# EAGLE design MO_v1 (EAGLE 7.1.0)
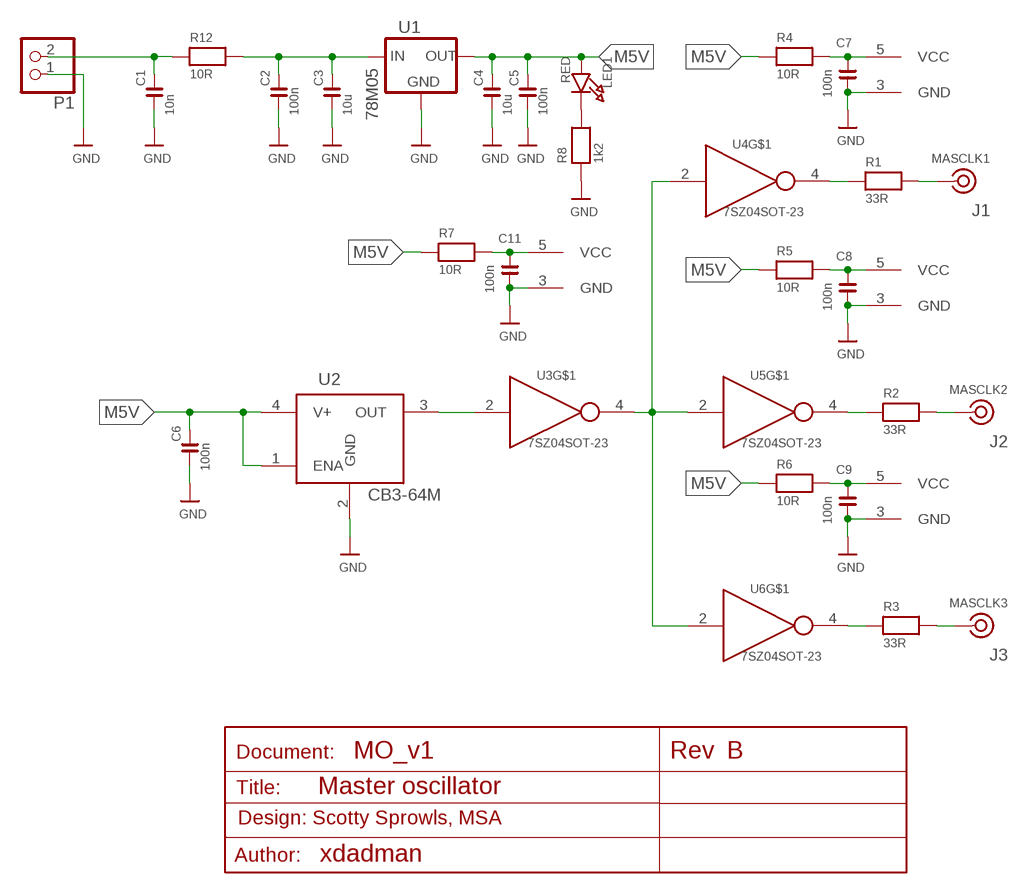
[diagram p0: schematic, sheet 1]

## Parts
C1  10n  C080510N  [C0805]
C2  100n  C0805100N  [C0805]
C3  10u  CC120610U  [C1206]
C4  10u  CC120610U  [C1206]
C5  100n  C0805100N  [C0805]
C6  100n  C0805100N  [C0805]
C7  100n  C0805100N  [C0805]
C8  100n  C0805100N  [C0805]
C9  100n  C0805100N  [C0805]
C11  100n  C0805100N  [C0805]
J1  MASCLK1  COAX  [SLIM_COAX_PAD]
J2  MASCLK2  COAX  [SLIM_COAX_PAD]
J3  MASCLK3  COAX  [SLIM_COAX_PAD]
LED1  RED  LED_0603_RED0603  [CHIPLED_0603]
P1  PINHD-1X2  [1X02]
R1  33R  R0805R33  [R0805]
R2  33R  R0805R33  [R0805]
R3  33R  R0805R33  [R0805]
R4  10R  R080510R  [R0805]
R5  10R  R080510R  [R0805]
R6  10R  R080510R  [R0805]
R7  10R  R080510R  [R0805]
R8  1k2  R08051K2  [R0805]
R12  10R  R080510R  [R0805]
U1  78M05  78MXXLDPAK  [TO252]
U2  CB3-64M  [CB3-64M]
U3  7SZ04SOT-23  [SOT23-5L]
U4  7SZ04SOT-23  [SOT23-5L]
U5  7SZ04SOT-23  [SOT23-5L]
U6  7SZ04SOT-23  [SOT23-5L]

## Nets
+10V: C1.2 P1.2 R12.1
GND: C1.1 C2.1 C3.1 C4.1 C5.1 C6.1 C7.1 C8.1 C9.1 C11.1 P1.1 R8.1 U1.3(GND) U2.2(GND) U3.3(GND) U4.3(GND) U5.3(GND) U6.3(GND)
M5V: C4.2 C5.2 C6.2 LED1.A R4.1 R5.1 R6.1 R7.1 U1.2(OUT) U2.1(ENA) U2.4(V+)
N$1: C2.2 C3.2 R12.2 U1.1(IN)
N$2: U2.3(OUT) U3.2(IN)
N$3: C7.2 R4.2 U4.5(VCC)
N$4: C11.2 R7.2 U3.5(VCC)
N$5: C8.2 R5.2 U5.5(VCC)
N$6: U3.4(OUT) U4.2(IN) U5.2(IN) U6.2(IN)
N$7: C9.2 R6.2 U6.5(VCC)
N$8: R1.1 U4.4(OUT)
N$9: R2.1 U5.4(OUT)
N$10: R3.1 U6.4(OUT)
N$11: J3.SIG R3.2
N$12: J2.SIG R2.2
N$13: J1.SIG R1.2
N$14: LED1.C R8.2

## Notes on the sheet
- B
- Master oscillator
- Design: Scotty Sprowls, MSA
- xdadman

## Power pins joined to a net without a drawn wire
GND: J1.GND J2.GND J3.GND

## Library data of the parts
C1 = MSA_lib:C0805: Ceramic capacitor; OC_FARNELL: 1414662
C2 C5-C9 C11 = MSA_lib:C0805: Ceramic capacitor; OC_FARNELL: 1759166
C3 C4 = MSA_lib:CC1206: Capacitor ceramic 1206; OC_FARNELL: 1611967
J1-J3 = MSA_lib:COAX
LED1 = MSA_lib:LED_0603_RED: Chip LED 0603 RED 2ma; OC_FARNELL: 1685068
P1 = MSA_lib:PINHD-1X2: PIN HEADER
R1-R3 = MSA_lib:R0805: Resistors; OC_FARNELL: 8867542
R4-R7 R12 = MSA_lib:R0805: Resistors; OC_FARNELL: 2332043
R8 = MSA_lib:R0805: Resistors; OC_FARNELL: 9333827
U1 = MSA_lib:78MXXL: VOLTAGE REGULATOR; OC_FARNELL: 2382524
U2 = MSA_lib:CB3-64M: Crystal oscilator; OC_DIGIKEY: CTX286CT-ND
U3-U6 = MSA_lib:7SZ04; OC_FARNELL: 1417667

## Board

Size 32 x 32 mm. Coordinates in mm from the lower left corner, seen from the top.
Outline: 0,0 32,0 32,32 0,32 0,0
Copper layers (1*16): Top 0.035mm / dielectric 1.5mm / Bottom 0.035mm
Design rules "kuba_no_CLR": minimum track width 8mil, minimum drill 15mil, track to track 8mil, track to pad 8mil, pad to pad 8mil, via to via 8mil, smd to smd 8mil, copper to edge 0mil, drill to drill 8mil, minimum pad ring 12mil, minimum via ring 10mil, stop-mask expansion 4mil, vias tented up to drill 0mil, thermal gap 10mil

### Footprints (pad centres in the part's own frame; a part is rotated, then mirrored left to right if it is on the bottom)
C0805 = smd 1.2 x 1.5: 1 -0.953,0; 2 0.953,0
C1206 = smd 1.6 x 1.8: 1 -1.4,0; 2 1.4,0
SLIM_COAX_PAD = smd 1.27 x 0.635 bottom: GND 0,-2.667 | drill 1.1: SIG 0,0
CHIPLED_0603 = smd 0.8 x 0.8: A 0,-0.75; C 0,0.75
1X02 = drill 1.016: 1 -1.27,0; 2 1.27,0
R0805 = smd 1.3 x 1.5: 1 -0.95,0; 2 0.95,0
TO252 = smd 1 x 1.6: 1 -2.28,-4.8; 2 2.28,-4.8 | smd 5.4 x 6.2: 3 0,2.5
CB3-64M = smd 1.8 x 2.1: 1 -2.5,-2.1; 2 2.5,-2.1; 3 2.5,2.1; 4 -2.5,2.1
SOT23-5L = smd 0.55 x 1.2: 1 -0.95,-1.3; 2 0,-1.3; 3 0.95,-1.3; 4 0.95,1.3; 5 -0.95,1.3

### Placement (x,y rotation side)
C1  21.08,5.33 180 top
C2  23.88,4.32 270 top
C3  26.42,4.83 270 top
C4  26.42,8.64 180 top
C5  22.86,8.13 90 top
C6  27.69,14.99 270 top
C7  12.7,22.1 180 top
C8  18.29,23.11 90 top
C9  9.91,17.78 270 top
C11  17.27,14.73 180 top
J1  6.1,25.65 180 top
J2  25.91,25.65 180 top
J3  6.1,11.43 270 top
LED1  20.57,10.16 90 top
P1  14.48,5.33 0 top
R1  8.64,25.65 180 top
R2  23.37,25.65 0 top
R3  6.1,13.72 270 top
R4  8.89,22.1 0 top
R5  20.07,27.18 270 top
R6  9.91,13.97 90 top
R7  16.51,8.64 90 top
R8  18.29,11.18 270 top
R12  18.29,4.32 270 top
U1  8.38,5.08 90 top
U2  22.86,14.99 90 top
U3  17.27,17.53 90 top
U4  12.45,24.64 90 top
U5  21.08,23.11 0 top
U6  7.11,17.53 180 top

### Tracks (layer width: path | path; a pad name or v marks a point on that pad's centre or on a via)
+10V
  Top 0.813: P1.2 18.35,5.33 | C1.2 18.35,5.33 | 18.35,5.33 R12.1
GND  (via drill 0.5)  (1 unrouted)
  Top 0.406: R8.1 v18.29,12.95
  Top 0.61: U2.2 26.12,17.49 v26.16,17.53 | U5.3 22.03,21.4 v22.35,21.08 | U3.3 18.73,18.48 v19.05,18.8 | C11.1 v19.05,14.73 | C7.1 13.65,21.91 v14.22,21.34 | C9.1 10.6,18.73 v10.67,18.8 | U6.3 6.16,18.98 v5.84,19.3 | U4.3 14.41,25.59 v14.48,25.65 | 29.97,8.51 29.97,5.33 | C8.1 v18.29,21.34 | v29.72,6.35 29.72,5.59 29.97,5.33 | 30.23,5.08 29.97,5.33
  Top 0.813: U2.2 25.44,17.49 26.92,16 27.62,16 C6.1 | C4.1 29.84,8.64 29.97,8.51 | C5.1 22.04,6.35 C1.1 23.81,5.33 C2.1 24.83,5.27 25.65,6.1 26.29,6.1 C3.1
  Top 1.016: 1.78,1.52 4.57,1.52 | 1.78,0.51 4.57,0.51
  Bottom 0.406: v18.29,12.95 18.29,12.7
  Bottom 0.61: v26.16,17.53 25.91,17.53 | v22.35,21.08 22.35,20.57 | v19.05,18.8 19.3,18.8 | v19.05,14.73 18.8,14.73 | v14.22,21.34 14.22,21.08 | v10.67,18.8 10.92,18.8 | v5.84,19.3 5.59,19.3 5.33,19.05 | v14.48,25.65 14.48,25.91 14.73,26.16 | v29.72,6.35 29.72,4.06 | v18.29,21.34 17.78,21.34
  other vias: 2.03,1.78 11.18,1.52 6.86,3.3 6.6,7.37 3.81,7.37 3.81,3.3 2.03,5.84 2.03,10.16 2.03,13.97 2.03,18.29 15.75,1.52 21.34,1.52 29.72,1.52 25.65,1.52 2.03,22.1 2.03,26.42 2.03,29.97 6.35,29.97 10.41,29.97 14.22,29.97 18.03,29.97 22.1,29.97 25.65,29.97 29.46,29.97 29.97,25.4 29.97,20.32 29.97,16.26 29.97,10.92 26.42,6.35
  pour Top (no thermals): 3.3,0 32,0 32,32 0,32 0,0 3.05,0 3.05,28.96 28.96,28.96 28.96,2.03 3.3,2.03
  pour Bottom: 0,0 32,0 32,32 0,32
M5V
  Top 0.406: LED1.A 21.32,9.16 21.34,9.14
  Top 0.61: 3.81,22.1 3.81,26.67 5.08,27.94 19.88,27.94 R5.1 | R6.1 9.91,9.65 | R4.1 3.81,22.1 | 3.81,22.1 3.81,10.67 5.08,9.4 9.91,9.4 10.03,9.53
  Top 0.813: 9.91,9.65 10.03,9.53 12.19,7.37 U1.2 16.18,7.36 R7.1 18.86,7.69 20.32,9.14 21.34,9.14 22.8,9.14 C5.2 | C6.2 27.5,14.22 27.18,14.22 25.44,12.49 U2.1 24.96,9.14 | 24.96,9.14 24.96,8.69 C4.2 | C5.2 24.9,9.08 24.96,9.14 | U2.4 20.79,12.49 22.86,10.41 C5.2
N$1
  Top 0.813: U1.1 13.44,3.05 17.97,3.05 R12.2 C2.2 26.36,3.37 C3.2
N$2
  Top 0.61: U3.2 20.72,17.53 U2.3
N$3
  Top 0.61: R4.2 11.18,22.1 | 11.18,22.1 C7.2 | U4.5 11.15,22.13 11.18,22.1
N$4
  Top 0.61: U3.5 15.97,15.08 C11.2 16.51,14.54 R7.2
N$5
  Top 0.61: R5.2 20.13,26.16 U5.5 18.64,24.41 C8.2
N$6
  Top 0.61: U4.2 14.99,24.64 15.75,23.88 15.75,20.07 | 15.75,20.07 20.83,20.07 21.08,20.32 U5.2 | U6.2 7.11,19.56 7.62,20.07 15.75,20.07 | U3.4 15.75,18.7 15.75,20.07
N$7
  Top 0.61: U6.5 9.88,16.23 9.91,16.26 C9.2 R6.2
N$8
  Top 0.61: R1.1 11.08,25.65 U4.4
N$9
  Top 0.61: U5.4 22.03,25.27 R2.1
N$10
  Top 0.61: U6.4 6.16,14.73 R3.1
N$11
  Top 1.016: R3.2 J3.SIG
N$12
  Top 1.27: J2.SIG R2.2
N$13
  Top 1.27: J1.SIG R1.2
N$14
  Top 0.406: LED1.C 18.35,10.16 R8.2

### Text on the board
tPlace: J1-CLK1 | R2 | U4 | R5 | R1 | J2-CLK2 | U5 | R4 | C8 | C9 | C7 | U2 | U6 | U3 | C6 | C11 | R3 | R6 | Master | Oscilator | R8 | J3-CLK3 | R7 | C5 | C4 | U1 | LED | P1 | C1 | R12 | +10V | C2 | C3